# Altium project hyb.PrjPcb
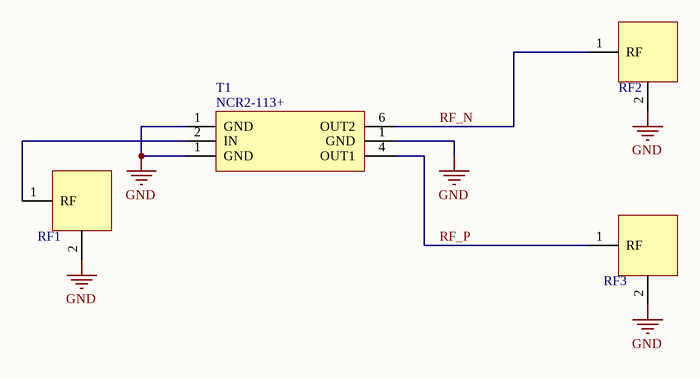
[diagram p0: hyb.SchDoc]
1 sheet, 4 parts. Net scope: global (net labels, ports and power ports of the same name join across sheets).
Board file: hyb.PcbDoc

## Sheet hyb.SchDoc
size A

### Parts
RF1  SMA Coaxial 50 ohm  [SMA Coaxial 50 ohm]  (value not drawn)
RF2  SMA Coaxial 50 ohm  [SMA Coaxial 50 ohm]  (value not drawn)
RF3  SMA Coaxial 50 ohm  [SMA Coaxial 50 ohm]  (value not drawn)
T1  PartNumber: NCR2-113+  [NCR2-Series]  (hidden comment: NCR2-113)

### Nets
GND: RF1.2(GND) RF2.2(GND) RF3.2(GND) T1.1(GND)
RF_N: RF2.1(RF) T1.6(OUT2)
RF_P: RF3.1(RF) T1.4(OUT1)
NetRF1_1: RF1.1(RF) T1.2(IN)

### Library data of the parts
RF1-RF3 = SMA Coaxial 50 ohm: 142-0701-801
T1 = NCR2-113: 3.5-11 GHz balun (180), smd